# EAGLE design inrof1.2 (EAGLE 9.6.2)
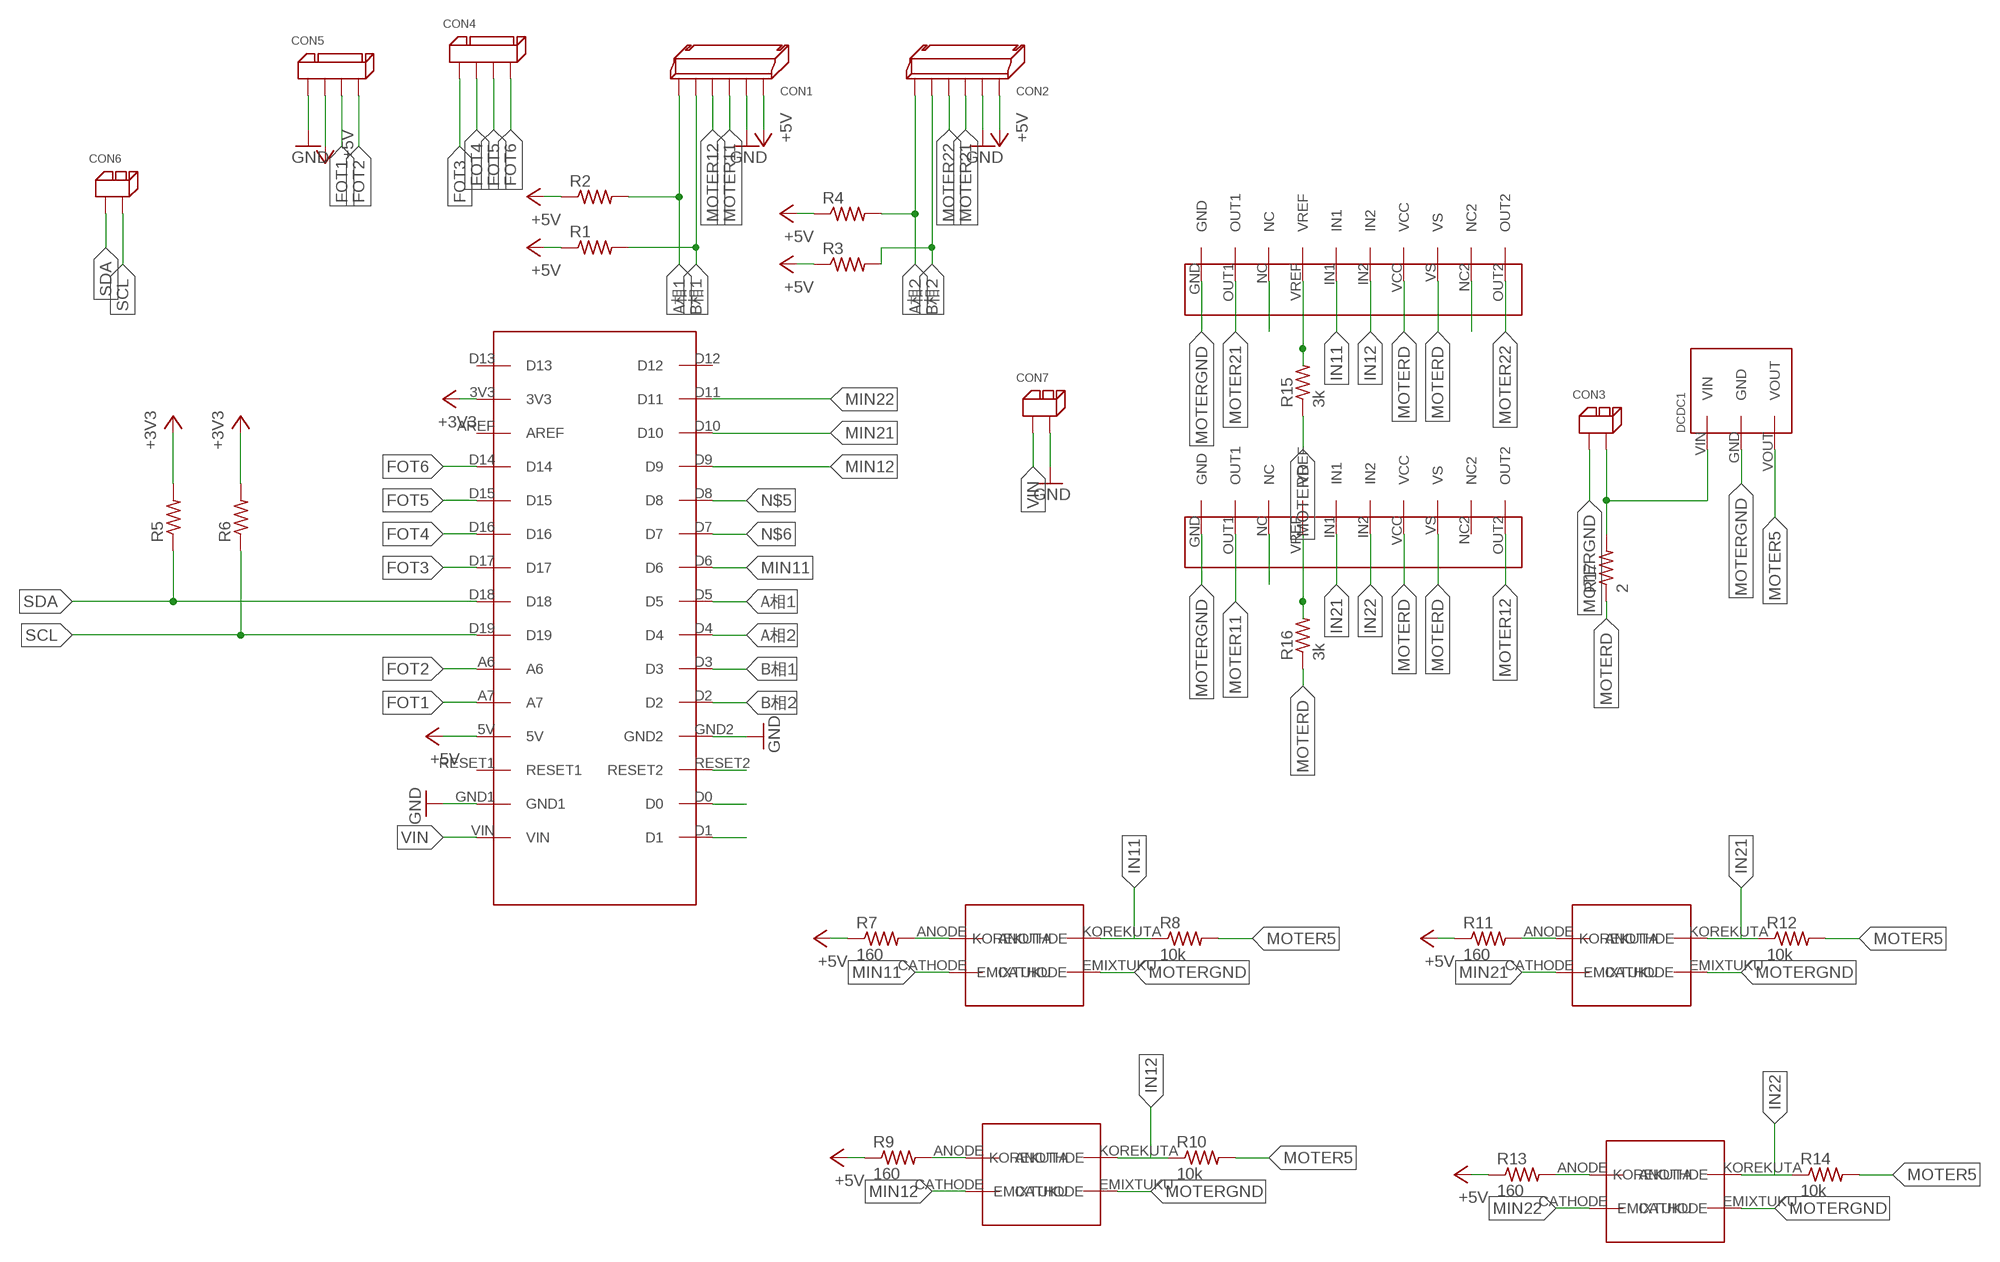
[diagram p0: schematic, sheet 1]

## Parts
CON1  6PIN_SIDE  [6PIN_SIDE]
CON2  6PIN_SIDE  [6PIN_SIDE]
CON3  2PIN  [2PIN]
CON4  4PIN  [4PIN]
CON5  4PIN  [4PIN]
CON6  2PIN  [2PIN]
CON7  2PIN  [2PIN]
DCDC1  5V1A_M78AR05-1  [5V1A_M78AR05-1]
R1  R-US_0204/7  [0204/7]
R2  R-US_0204/7  [0204/7]
R3  R-US_0204/7  [0204/7]
R4  R-US_0204/7  [0204/7]
R5  R-US_0204/7  [0204/7]
R6  R-US_0204/7  [0204/7]
R7  160  R-US_0204/7  [0204/7]
R8  10k  R-US_0204/7  [0204/7]
R9  160  R-US_0204/7  [0204/7]
R10  10k  R-US_0204/7  [0204/7]
R11  160  R-US_0204/7  [0204/7]
R12  10k  R-US_0204/7  [0204/7]
R13  160  R-US_0204/7  [0204/7]
R14  10k  R-US_0204/7  [0204/7]
R15  3k  R-US_0204/7  [0204/7]
R16  3k  R-US_0204/7  [0204/7]
R17  2  R-US_0204/7  [0204/7]
U$1  ARDUINONANO  [ARDUINONANO]
U$2  TA7291P  [TA7291P]
U$3  TA7291P  [TA7291P]
U$4  TLP561  [TLP561]
U$5  TLP561  [TLP561]
U$6  TLP561  [TLP561]
U$7  TLP561  [TLP561]

## Nets
+3V3: R5.2 R6.2 U$1.3V3
+5V: CON1.P$6 CON2.P$6 CON5.P$2 R1.1 R2.1 R3.1 R4.1 R7.1 R9.1 R11.1 R13.1 U$1.5V
A相1: CON1.P$1 R2.2 U$1.D5
A相2: CON2.P$1 R4.2 U$1.D4
B相1: CON1.P$2 R1.2 U$1.D3
B相2: CON2.P$2 R3.2 U$1.D2
FOT1: CON5.P$3 U$1.A7
FOT2: CON5.P$4 U$1.A6
FOT3: CON4.P$1 U$1.D17
FOT4: CON4.P$2 U$1.D16
FOT5: CON4.P$3 U$1.D15
FOT6: CON4.P$4 U$1.D14
GND: CON1.P$5 CON2.P$5 CON5.P$1 CON7.P$2 U$1.GND1 U$1.GND2
IN11: R8.1 U$2.IN1 U$4.KOREKUTA
IN12: R10.1 U$2.IN2 U$5.KOREKUTA
IN21: R12.1 U$3.IN1 U$6.KOREKUTA
IN22: R14.1 U$3.IN2 U$7.KOREKUTA
MIN11: U$1.D6 U$4.CATHODE
MIN12: U$1.D9 U$5.CATHODE
MIN21: U$1.D10 U$6.CATHODE
MIN22: U$1.D11 U$7.CATHODE
MOTER5: DCDC1.VOUT R8.2 R10.2 R12.2 R14.2
MOTER11: CON1.P$4 U$3.OUT1
MOTER12: CON1.P$3 U$3.OUT2
MOTER21: CON2.P$4 U$2.OUT1
MOTER22: CON2.P$3 U$2.OUT2
MOTERD: CON3.P$2 DCDC1.VIN R15.1 R16.1 R17.1 R17.2 U$2.VCC U$2.VS U$3.VCC U$3.VS
MOTERGND: CON3.P$1 DCDC1.GND U$2.GND U$3.GND U$4.EMIXTUKU U$5.EMIXTUKU U$6.EMIXTUKU U$7.EMIXTUKU
N$1: R7.2 U$4.ANODE(ANOTHDE)
N$2: R15.2 U$2.VREF
N$3: R16.2 U$3.VREF
N$4: R9.2 U$5.ANODE(ANOTHDE)
N$5: U$1.D8
N$6: U$1.D7
N$9: R11.2 U$6.ANODE(ANOTHDE)
N$10: R13.2 U$7.ANODE(ANOTHDE)
N$13: U$1.RESET2
N$14: U$1.D0
N$15: U$1.D1
N$18: U$3.NC
N$27: U$2.NC
N$33: U$2.NC2
SCL: CON6.P$2 R6.1 U$1.D19
SDA: CON6.P$1 R5.1 U$1.D18
VIN: CON7.P$1 U$1.VIN
Unconnected: U$1.AREF U$1.D12 U$1.D13 U$1.RESET1 U$3.NC2

## Library data of the parts
CON1 CON2 = XR Connector:6PIN_SIDE
CON3 CON6 CON7 = XR Connector:2PIN
CON4 CON5 = XR Connector:4PIN
DCDC1 = DC-DC:5V1A_M78AR05-1
R1-R17 = rcl:R-US_: RESISTOR, American symbol; SPICEPREFIX: R
U$1 = arduinonano device:ARDUINONANO
U$2 U$3 = tA7291P:TA7291P
U$4-U$7 = TLP561:TLP561

## Board
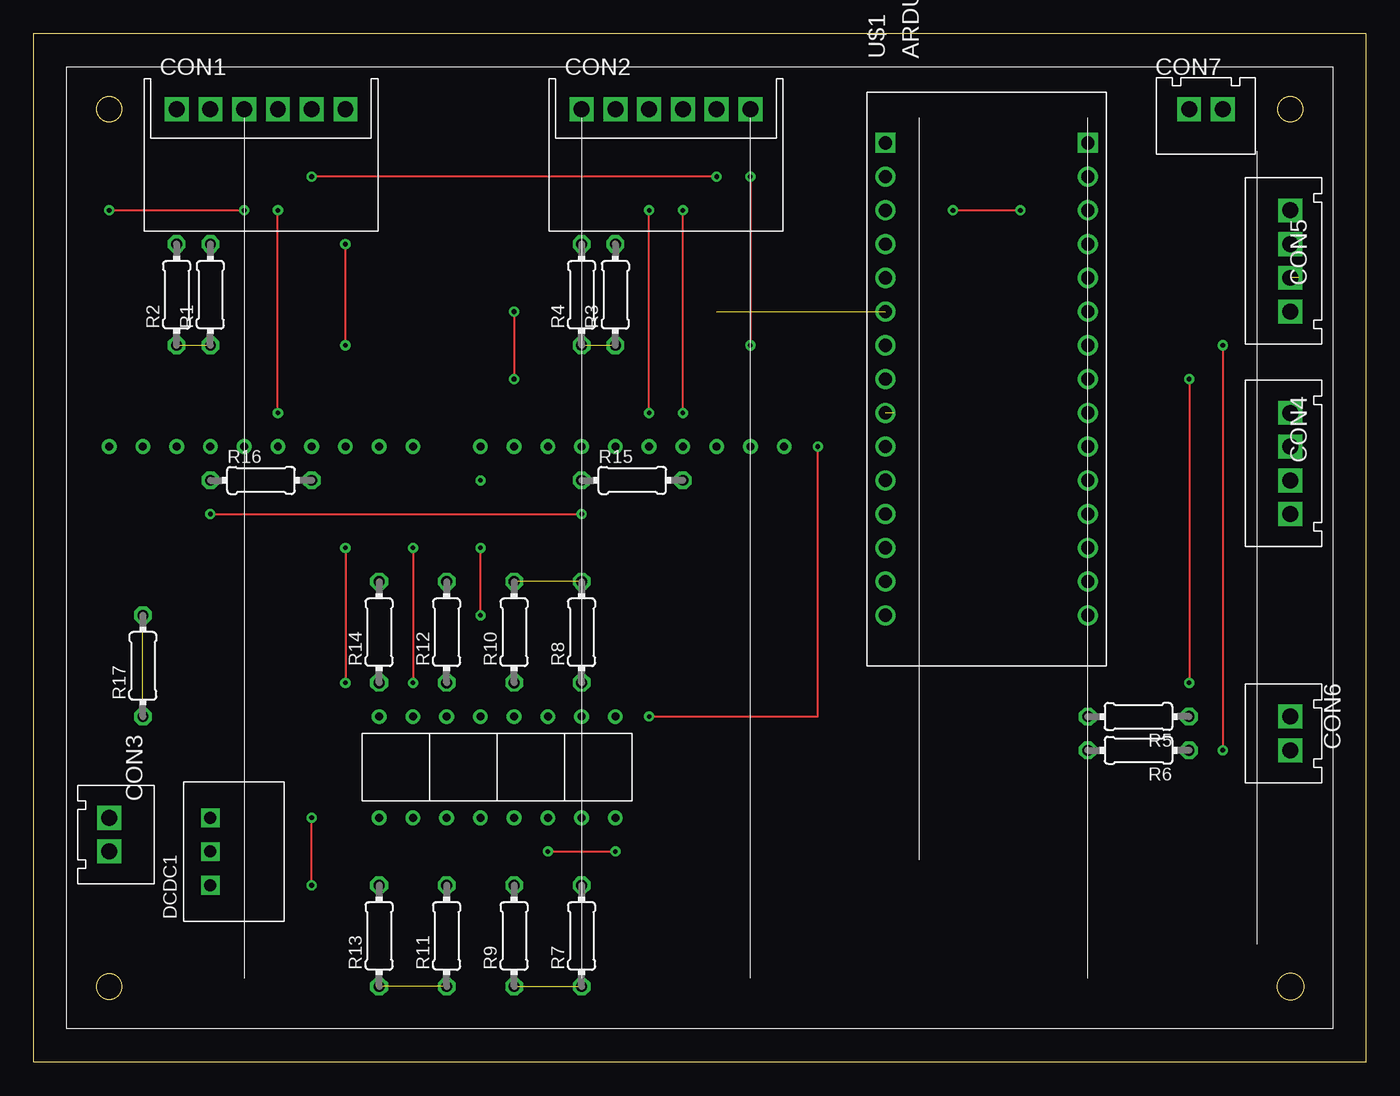
[diagram p1: board, top side]
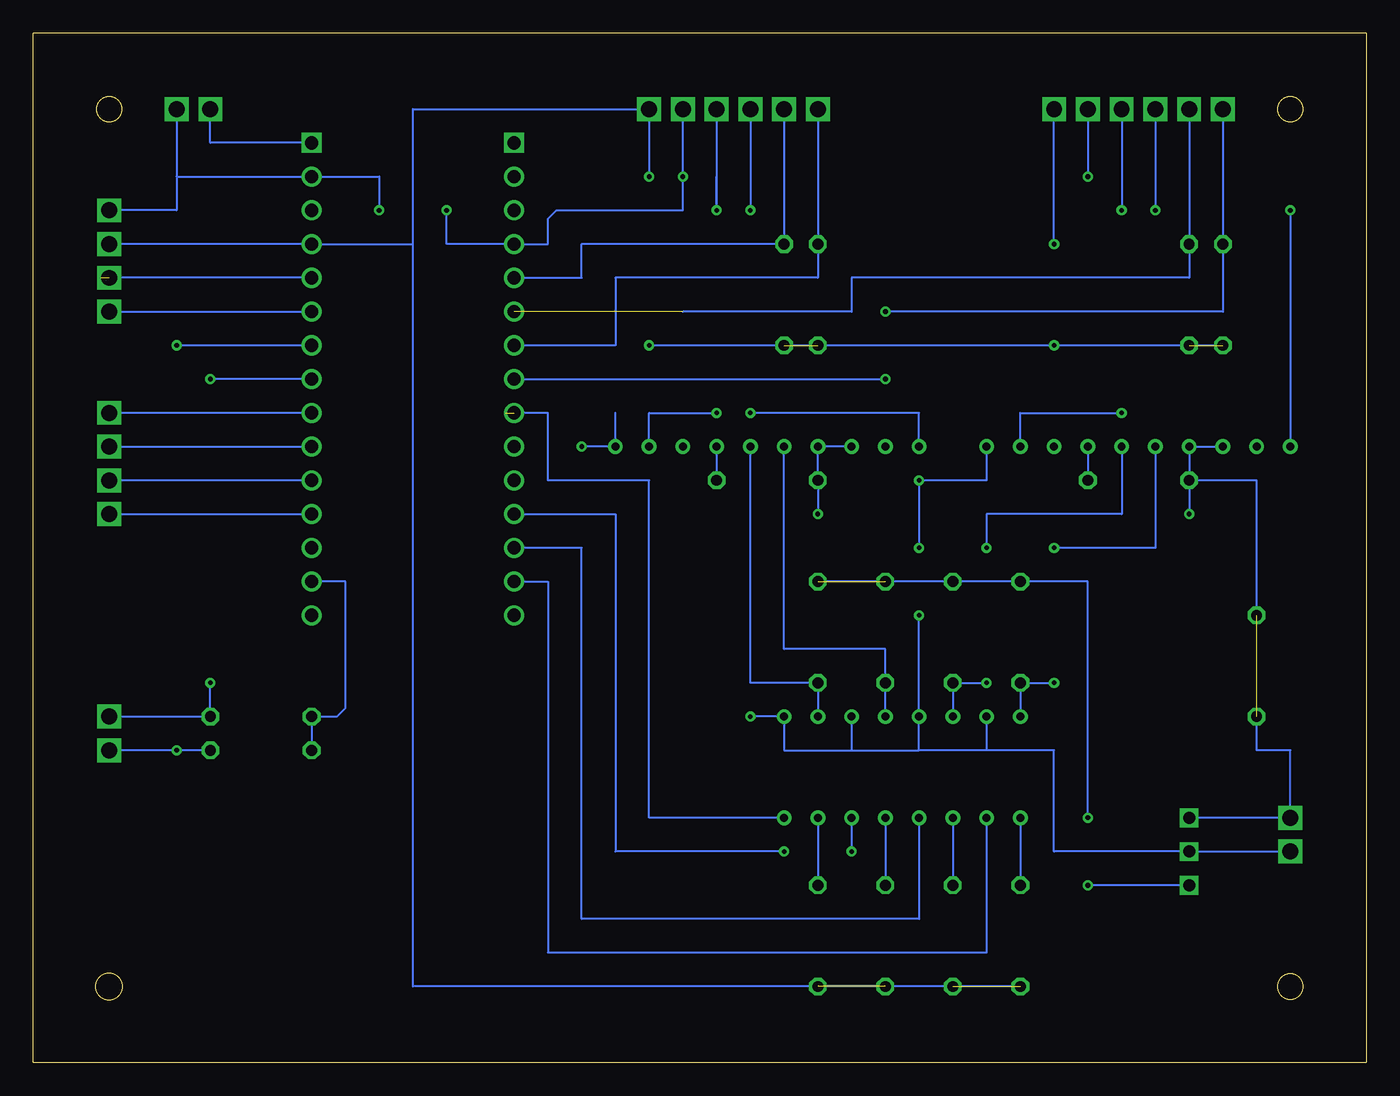
[diagram p2: board, bottom side, seen from below]

Size 100.33 x 77.47 mm. Coordinates in mm from the lower left corner, seen from the top.
Outline: 0,77.47 100.33,77.47 100.33,0 0,0 0,77.47
Outline: circle at 5.71,5.71 radius 0.95
Outline: circle at 5.71,71.75 radius 0.95
Outline: circle at 94.61,71.75 radius 0.95
Outline: circle at 94.61,5.71 radius 1
Copper layers (1*16): Top 0.035mm / dielectric 1.5mm / Bottom 0.035mm
Design rules "default": minimum track width 6mil, minimum drill 0.35mm, track to track 6mil, track to pad 6mil, pad to pad 6mil, via to via 6mil, smd to smd 6mil, copper to edge 40mil, drill to drill 6mil, minimum pad ring 10mil, minimum via ring 8mil, stop-mask expansion 4mil, vias tented up to drill 0mil, thermal gap 10mil
tKeepout: area 10.2,5.1 to 11.4,6.3; area 10.2,7.6 to 11.4,8.9; area 10.2,10.2 to 11.4,11.4; area 12.7,5.1 to 14,6.3; area 12.7,7.6 to 14,8.9; area 12.7,10.2 to 14,11.4; area 15.2,5.1 to 16.5,6.3; area 15.2,7.6 to 16.5,8.9; area 15.2,10.2 to 16.5,11.4; area 17.8,5.1 to 19,6.3; area 17.8,7.6 to 19,8.9; area 17.8,10.2 to 19,11.4; 948 more areas

### Footprints (pad centres in the part's own frame; a part is rotated, then mirrored left to right if it is on the bottom)
6PIN_SIDE = drill 1.2 square: P$1 -6.35,0; P$2 -3.81,0; P$3 -1.27,0; P$4 1.27,0; P$5 3.81,0; P$6 6.35,0
2PIN = drill 1.2 square: P$1 -1.27,0; P$2 1.27,0
4PIN = drill 1.2 square: P$1 2.54,-2.54; P$2 5.08,-2.54; P$3 7.62,-2.54; P$4 10.16,-2.54
5V1A_M78AR05-1 = drill 0.9 pad 1.27 square: GND 0,0; VIN 2.54,0; VOUT -2.54,0
0204/7 = drill 0.813 octagon: 1 -3.81,0; 2 3.81,0
ARDUINONANO = drill 1: 3V3 3.81,-16.51; 5V 29.21,-16.51; A6 24.13,-16.51; A7 26.67,-16.51; AREF 6.35,-16.51; D0 34.29,-1.27; D2 26.67,-1.27; D3 24.13,-1.27; D4 21.59,-1.27; D5 19.05,-1.27; D6 16.51,-1.27; D7 13.97,-1.27; D8 11.43,-1.27; D9 8.89,-1.27; D10 6.35,-1.27; D11 3.81,-1.27; D12 1.27,-1.27; D13 1.27,-16.51; D14 8.89,-16.51; D15 11.43,-16.51; D16 13.97,-16.51; D17 16.51,-16.51; D18 19.05,-16.51; D19 21.59,-16.51; GND1 34.29,-16.51; GND2 29.21,-1.27; RESET1 31.75,-16.51; RESET2 31.75,-1.27 | drill 1 square: D1 36.83,-1.27; VIN 36.83,-16.51
TA7291P = drill 0.6: GND 0,0; IN1 10.16,0; IN2 12.7,0; NC 5.08,0; NC2 20.32,0; OUT1 2.54,0; OUT2 22.86,0; VCC 15.24,0; VREF 7.62,0; VS 17.78,0
TLP561 = drill 0.6: ANODE 0,-7.62; CATHODE 2.54,-7.62; EMIXTUKU 2.54,0; KOREKUTA 0,0

### Placement (x,y rotation side)
CON1  17.14,71.75 0 top
CON2  47.62,71.75 0 top
CON3  5.71,17.14 90 top
CON4  97.16,51.44 270 top
CON5  97.16,66.67 270 top
CON6  94.61,24.77 270 top
CON7  88.27,71.75 0 top
DCDC1  13.34,15.87 90 top
R1  13.34,57.78 90 top
R2  10.8,57.78 90 top
R3  43.81,57.78 90 top
R4  41.28,57.78 90 top
R5  83.19,26.04 180 top
R6  83.19,23.5 180 top
R7  41.28,9.53 90 top
R8  41.28,32.38 90 top
R9  36.2,9.53 90 top
R10  36.2,32.38 90 top
R11  31.12,9.53 90 top
R12  31.12,32.38 90 top
R13  26.03,9.53 90 top
R14  26.03,32.38 90 top
R15  45.08,43.81 0 top
R16  17.14,43.81 0 top
R17  8.26,29.84 90 top
U$1  62.86,32.38 90 top
U$2  56.52,46.36 180 top
U$3  28.58,46.36 180 top
U$4  41.28,26.04 0 top
U$5  36.2,26.04 0 top
U$6  31.12,26.04 0 top
U$7  26.03,26.04 0 top

### Tracks (layer width: path | path; a pad name or v marks a point on that pad's centre or on a via)
+3V3
  Bottom 0.152: R6.2 R5.2 77.47,26.04 76.83,26.67 76.83,36.2 U$1.3V3
+5V  (via drill 0.35)  (4 unrouted)
  Top 0.152: v53.97,66.67 v53.97,53.97 | v23.49,53.97 v23.49,61.59
  Bottom 0.152: R13.1 R7.1 71.75,5.71 71.75,61.59 | 71.75,61.59 U$1.5V CON5.P$2 | 71.75,61.59 71.75,71.75 CON2.P$6 v53.97,66.67 | R2.1 v23.49,53.97 R3.1 v53.97,53.97 | v23.49,61.59 CON1.P$6
A相1  (via drill 0.35)
  Top 0.152: v36.2,56.52 v36.2,51.44
  Bottom 0.152: CON1.P$1 R2.2 10.8,56.52 v36.2,56.52 | U$1.D5 v36.2,51.44
A相2
  Bottom 0.152: CON2.P$1 R4.2 41.28,59.06 56.52,59.06 56.52,53.97 U$1.D4
B相1  (1 unrouted)
  Bottom 0.152: CON1.P$2 R1.2 13.34,59.06 38.73,59.06 38.73,56.52 51.44,56.52
B相2
  Bottom 0.152: CON2.P$2 R3.2 59.05,61.59 59.05,59.06 U$1.D2
FOT1  (1 unrouted)
  Bottom 0.152: U$1.A7 95.25,59.06
FOT2
  Bottom 0.152: CON5.P$4 U$1.A6
FOT3
  Bottom 0.152: U$1.D17 CON4.P$1
FOT4
  Bottom 0.152: CON4.P$2 U$1.D16
FOT5
  Bottom 0.152: U$1.D15 CON4.P$3
FOT6
  Bottom 0.152: CON4.P$4 U$1.D14
GND  (via drill 0.35)
  Top 0.152: v69.22,64.14 v74.3,64.14 | v51.44,66.67 v20.95,66.67
  Bottom 0.152: CON2.P$5 v51.44,66.67 51.44,64.14 60.96,64.14 61.59,63.5 61.59,61.59 U$1.GND2 69.22,61.59 v69.22,64.14 | CON1.P$5 v20.95,66.67 | v74.3,64.14 74.3,66.67 U$1.GND1 89.53,66.67 | CON7.P$2 89.53,66.67 | 89.53,66.67 89.53,64.14 CON5.P$1
IN11
  Bottom 0.152: U$4.KOREKUTA R8.1 46.36,28.58 U$2.IN1
IN12
  Bottom 0.152: U$5.KOREKUTA R10.1 36.2,31.12 43.81,31.12 U$2.IN2
IN21  (via drill 0.35)
  Top 0.152: v28.58,38.73 v28.58,28.58
  Bottom 0.152: U$6.KOREKUTA R12.1 v28.58,28.58 | U$3.IN1 18.41,41.27 28.58,41.27 v28.58,38.73
IN22  (via drill 0.35)
  Top 0.152: v23.49,38.73 v23.49,28.58
  Bottom 0.152: U$7.KOREKUTA R14.1 v23.49,28.58 | U$3.IN2 15.88,38.73 v23.49,38.73
MIN11  (1 unrouted)
  Bottom 0.152: 64.77,48.9 61.59,48.9 61.59,43.81 53.97,43.81 53.97,18.41 U$4.CATHODE
MIN12  (via drill 0.35)
  Top 0.152: v38.73,15.87 v43.81,15.87
  Bottom 0.152: U$5.CATHODE v38.73,15.87 | v43.81,15.87 56.52,15.87 56.52,41.27 U$1.D9
MIN21
  Bottom 0.152: U$1.D10 59.05,38.73 59.05,10.79 33.66,10.79 U$6.CATHODE
MIN22
  Bottom 0.152: U$7.CATHODE 28.58,8.26 61.59,8.26 61.59,36.2 U$1.D11
MOTER5  (via drill 0.35)  (1 unrouted)
  Top 0.152: v20.95,13.33 v20.95,18.41
  Bottom 0.152: DCDC1.VOUT v20.95,13.33 | v20.95,18.41 20.95,36.2 R14.2 R12.2 R8.2
MOTER11  (via drill 0.35)
  Top 0.152: v18.41,48.9 v18.41,64.14
  Bottom 0.152: U$3.OUT1 26.03,48.9 v18.41,48.9 | CON1.P$4 v18.41,64.14
MOTER12  (via drill 0.35)
  Top 0.152: v5.71,64.14 v15.88,64.14
  Bottom 0.152: v5.71,64.14 U$3.OUT2 | CON1.P$3 v15.88,64.14
MOTER21  (via drill 0.35)
  Top 0.152: v48.89,48.9 v48.89,64.14
  Bottom 0.152: U$2.OUT1 53.97,48.9 v48.89,48.9 | 48.89,66.67 v48.89,64.14 CON2.P$4
MOTER22  (via drill 0.35)
  Top 0.152: v46.36,48.9 v46.36,64.14
  Bottom 0.152: U$2.OUT2 33.66,48.9 v46.36,48.9 | CON2.P$3 v46.36,64.14
MOTERD  (via drill 0.35)  (1 unrouted)
  Top 0.152: v13.34,41.27 v41.28,41.27
  Bottom 0.152: R17.2 8.26,43.81 R16.1 | R16.1 U$3.VCC U$3.VS | R16.1 v13.34,41.27 | R17.1 8.26,23.5 5.71,23.5 CON3.P$2 DCDC1.VIN | U$2.VS U$2.VCC R15.1 v41.28,41.27
MOTERGND  (via drill 0.35)
  Top 0.152: v46.36,26.04 59.05,26.04 v59.05,46.36 | v33.66,33.66 v33.66,38.73
  Bottom 0.152: 38.73,23.5 43.81,23.5 U$4.EMIXTUKU v46.36,26.04 | U$5.EMIXTUKU 38.73,23.5 | 38.73,23.5 33.66,23.5 | 33.66,23.5 U$6.EMIXTUKU v33.66,33.66 | U$7.EMIXTUKU 28.58,23.5 | 28.58,23.5 33.66,23.5 | 28.58,23.5 23.49,23.5 23.49,15.87 DCDC1.GND CON3.P$1 | 56.52,48.9 U$2.GND v59.05,46.36 | U$3.GND 28.58,43.81 v33.66,43.81 v33.66,38.73
N$1
  Bottom 0.152: U$4.ANODE R7.2
N$2
  Bottom 0.152: U$2.VREF R15.2
N$3
  Bottom 0.152: U$3.VREF R16.2
N$4
  Bottom 0.152: U$5.ANODE R9.2
N$9
  Bottom 0.152: U$6.ANODE R11.2
N$10
  Bottom 0.152: U$7.ANODE R13.2
SCL  (via drill 0.35)
  Top 0.152: v89.53,53.97 v89.53,23.5
  Bottom 0.152: U$1.D19 v89.53,53.97 | R6.1 v89.53,23.5 CON6.P$2
SDA  (via drill 0.35)
  Top 0.152: v87,51.44 v87,28.58
  Bottom 0.152: U$1.D18 v87,51.44 | CON6.P$1 R5.1 v87,28.58
VIN
  Bottom 0.152: U$1.VIN 87,69.22 CON7.P$1